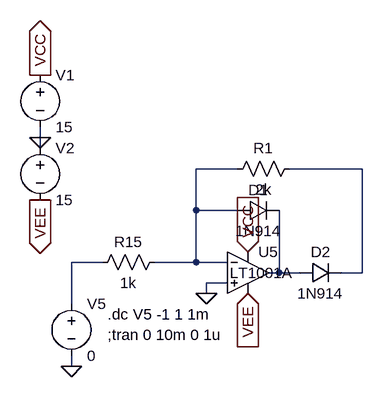
[diagram p0: schematic HalfWave.asc]
HalfWave.asc, the LTspice schematic file:
Version 4
SHEET 1 3400 680
WIRE 960 160 960 144
WIRE 960 176 960 160
WIRE 1264 208 1200 208
WIRE 1456 208 1344 208
WIRE 1200 272 1200 208
WIRE 1264 272 1200 272
WIRE 1056 352 1008 352
WIRE 1200 352 1200 272
WIRE 1200 352 1136 352
WIRE 1248 352 1200 352
WIRE 1328 368 1328 272
WIRE 1328 368 1312 368
WIRE 1360 368 1328 368
WIRE 1456 368 1456 208
WIRE 1456 368 1424 368
WIRE 1248 384 1216 384
WIRE 1216 400 1216 384
WIRE 1008 416 1008 352
WIRE 1008 512 1008 496
FLAG 960 160 0
FLAG 1008 512 0
FLAG 960 64 VCC
IOPIN 960 64 Out
FLAG 1280 336 VCC
IOPIN 1280 336 In
FLAG 960 256 VEE
IOPIN 960 256 Out
FLAG 1280 400 VEE
IOPIN 1280 400 In
FLAG 1216 400 0
SYMBOL voltage 960 48 R0
WINDOW 123 0 0 Left 2
WINDOW 39 0 0 Left 2
SYMATTR InstName V1
SYMATTR Value 15
SYMBOL voltage 960 160 R0
WINDOW 123 0 0 Left 2
WINDOW 39 0 0 Left 2
SYMATTR InstName V2
SYMATTR Value 15
SYMBOL Opamps\\LT1001A 1280 304 R0
WINDOW 3 -28 64 Left 2
SYMATTR InstName U5
SYMBOL res 1040 368 R270
WINDOW 0 32 56 VTop 2
WINDOW 3 0 56 VBottom 2
SYMATTR InstName R15
SYMATTR Value 1k
SYMBOL voltage 1008 400 R0
WINDOW 123 0 0 Left 2
WINDOW 39 0 0 Left 2
SYMATTR InstName V5
SYMATTR Value 0
SYMBOL diode 1264 288 R270
WINDOW 0 32 32 VTop 2
WINDOW 3 0 32 VBottom 2
SYMATTR InstName D1
SYMATTR Value 1N914
SYMBOL res 1248 224 R270
WINDOW 0 32 56 VTop 2
WINDOW 3 0 56 VBottom 2
SYMATTR InstName R1
SYMATTR Value 2k
SYMBOL diode 1360 384 R270
WINDOW 0 32 32 VTop 2
WINDOW 3 0 32 VBottom 2
SYMATTR InstName D2
SYMATTR Value 1N914
TEXT 1064 432 Left 2 !.dc V5 -1 1 1m
TEXT 1064 464 Left 2 !;tran 0 10m 0 1u

The netlist it stands for:
* HalfWave.asc
V1 VCC 0 15
V2 0 VEE 15
XU5 0 N001 VCC VEE N004 LT1001  ; LT1001A, pins In+ In- V+ V- OUT
R15 N003 N001 1k
V5 N003 0 0
D1 N001 N004 1N914
R1 N001 N002 2k
D2 N004 N002 1N914
.model D D
.lib standard.dio
.dc V5 -1 1 1m
;tran 0 10m 0 1u
.lib LTC.lib
.backanno
.end